# EAGLE design ts4231-breakout-module (EAGLE 6.5.0)
DESIGNER: Jon Newman; DESIGN_NAME: TS431 Breakout; LICENSE: cc-by-sa-nc; REVISION: 1.0
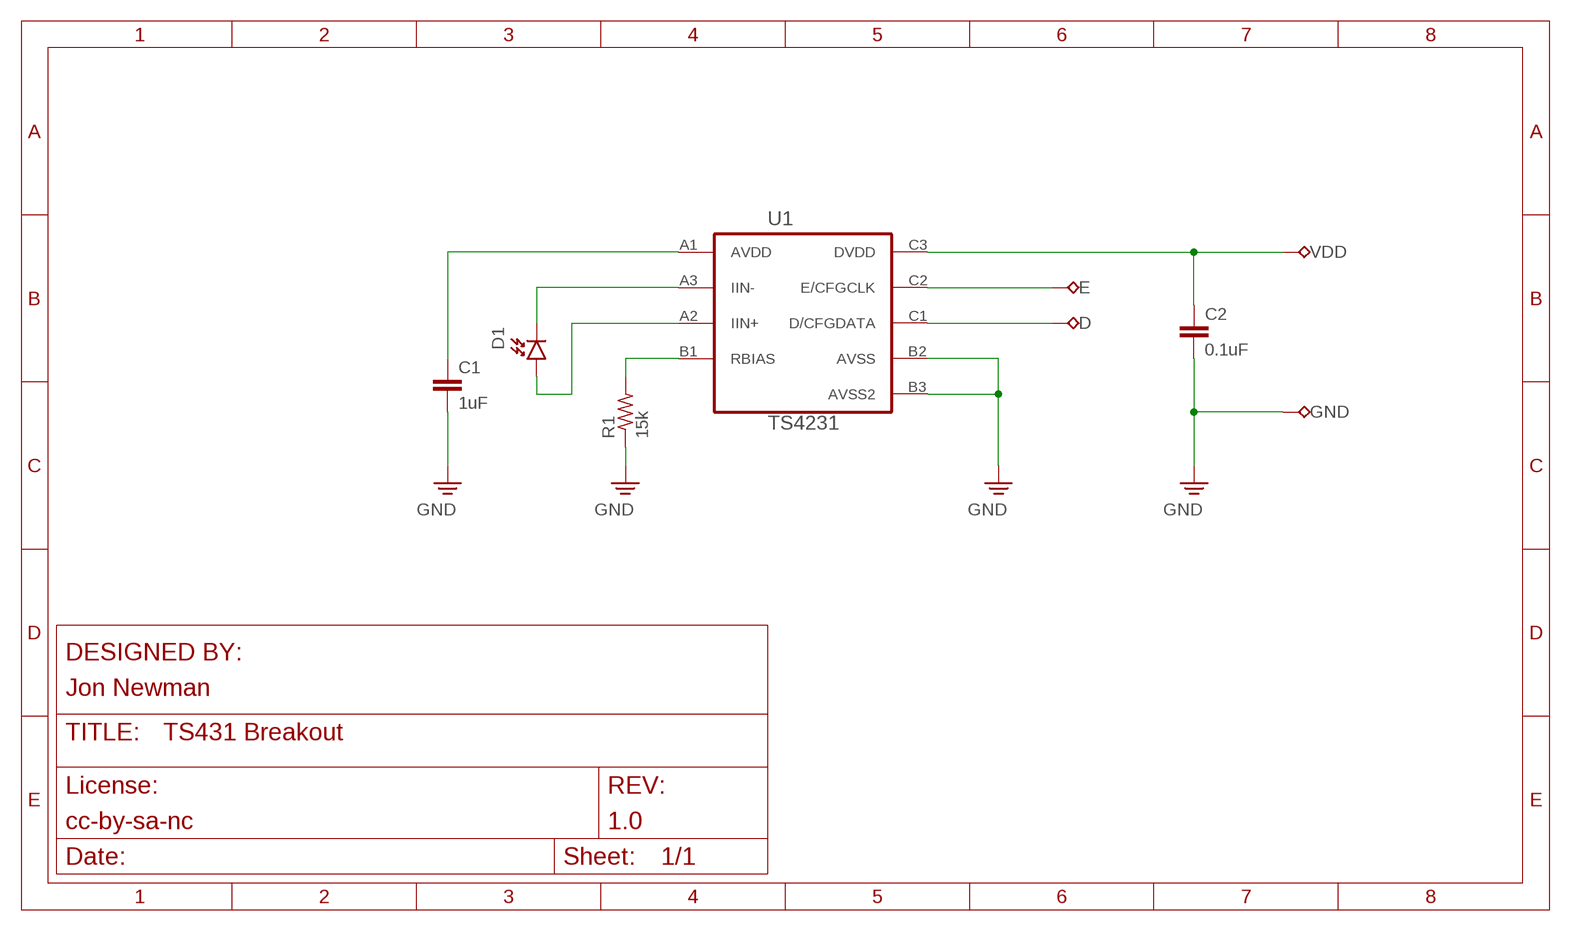
[diagram p0: schematic, sheet 1]

## Parts
C1  1uF  C_0402  [0402]
C2  0.1uF  C_0201  [0201]
D  TP_TP23MIL  [TP23MIL]
D1  PHOTODIODE_0805  [0805]
E  TP_TP23MIL  [TP23MIL]
GND  TP_TP23MIL  [TP23MIL]
R1  15k  R_0201  [0201]
U1  TS4231  [WLCSP3X3]
VDD  TP_TP23MIL  [TP23MIL]

## Nets
GND: C1.2 C2.2 GND.P$1(TP) R1.1 U1.B2(AVSS) U1.B3(AVSS2)
N$1: D.P$1(TP) U1.C1(D/CFGDATA)
N$2: E.P$1(TP) U1.C2(E/CFGCLK)
N$4: D1.2(C) U1.A3(IIN-)
N$5: D1.1(A) U1.A2(IIN+)
N$6: R1.2 U1.B1(RBIAS)
N$7: C1.1 U1.A1(AVDD)
VDD: C2.1 U1.C3(DVDD) VDD.P$1(TP)

## Library data of the parts
C1 C2 = jonnew:C: Capacitor
D E GND VDD = jonnew:TP: Test pad
D1 = jonnew:PHOTODIODE
R1 = jonnew:R: Resistor
U1 = jonnew:TS4231

## Board
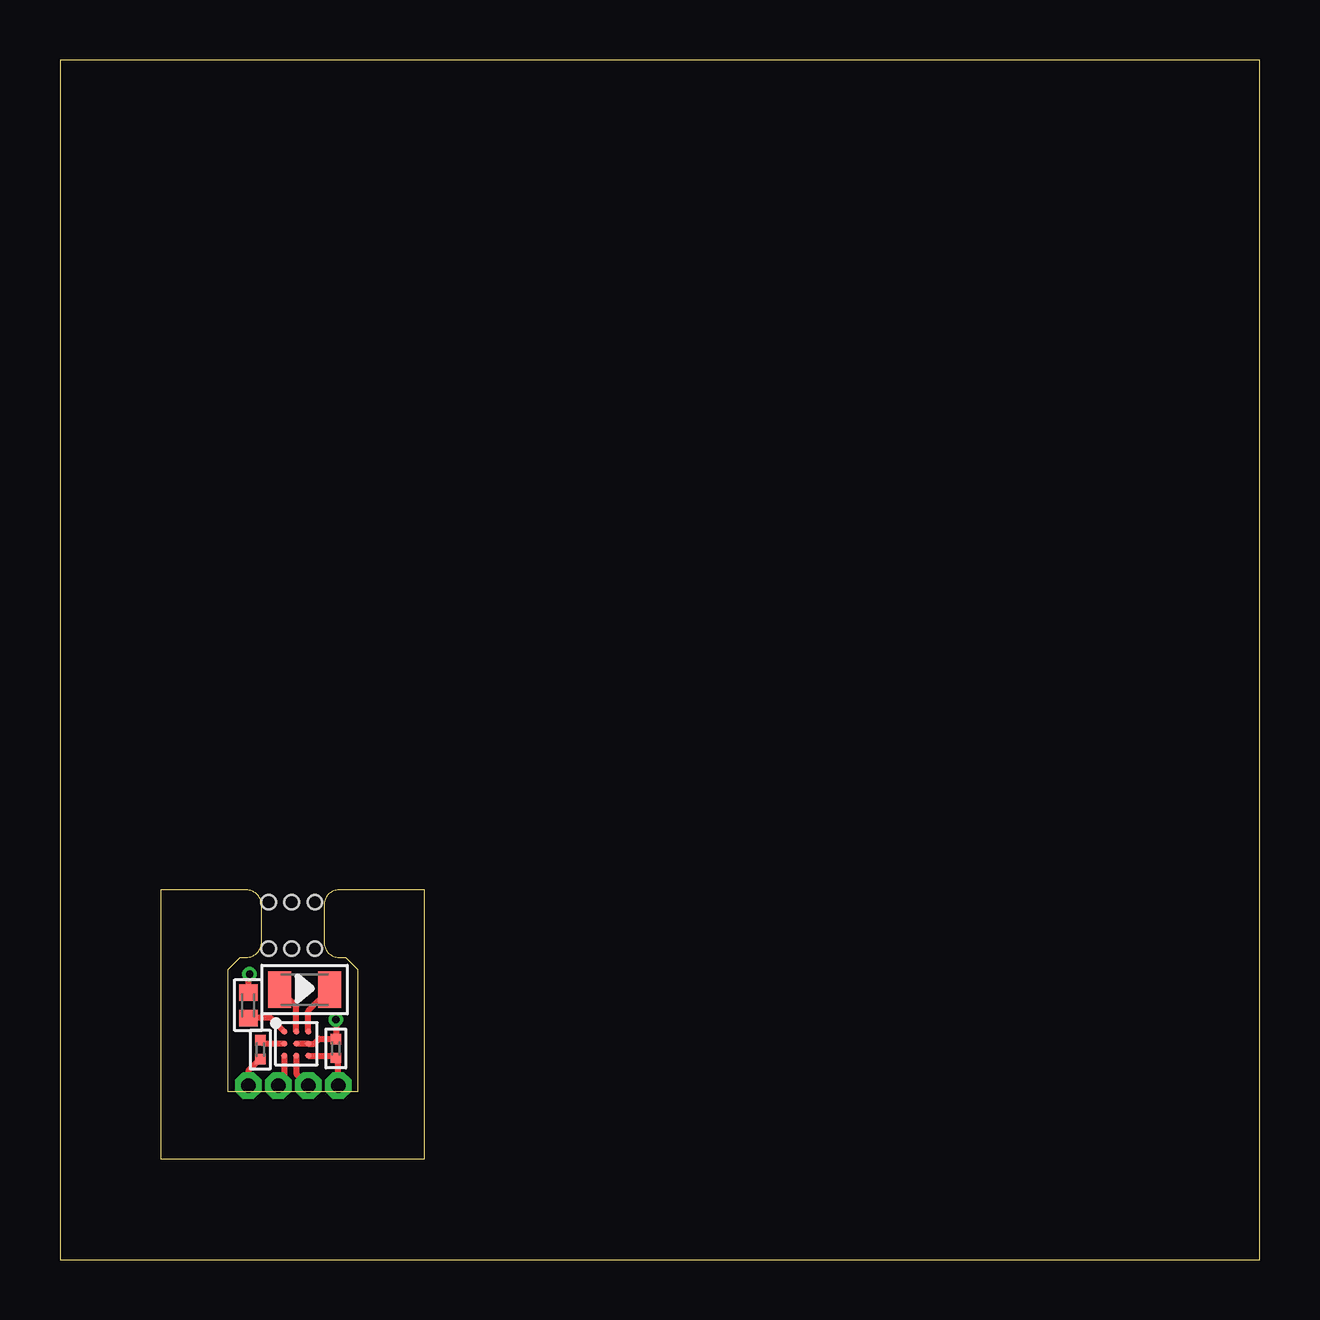
[diagram p1: board, top side]
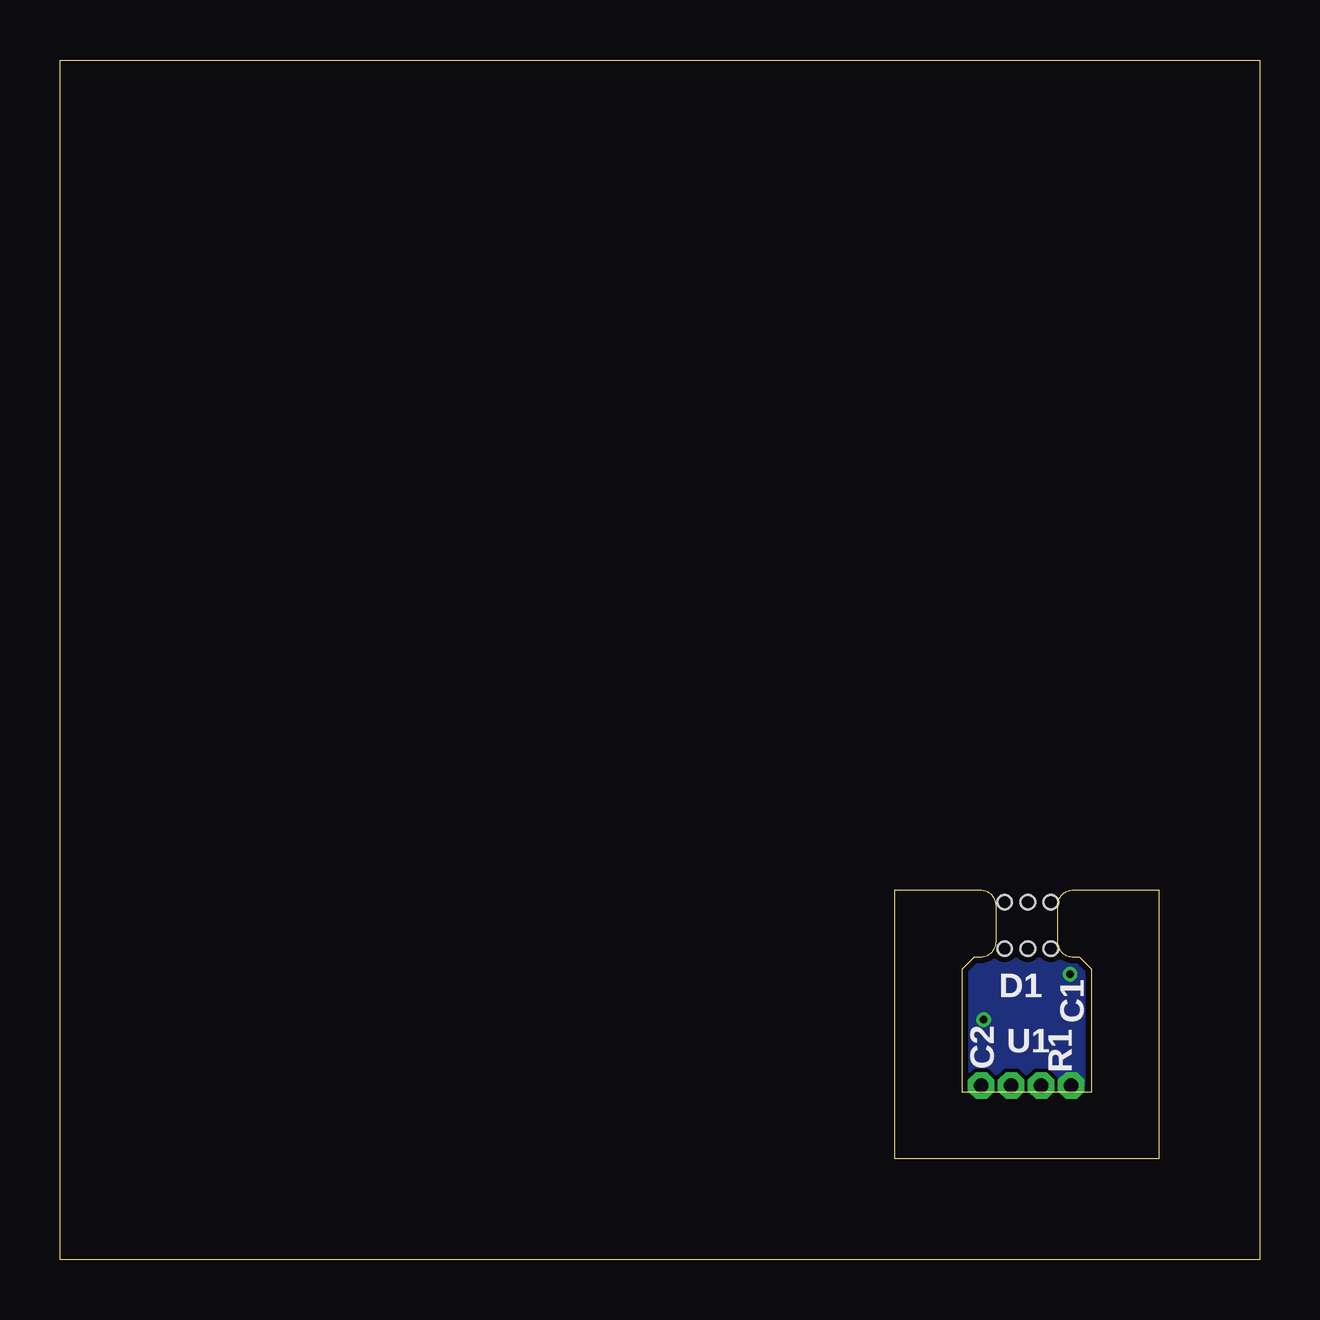
[diagram p2: board, bottom side, seen from below]

Size 50 x 50 mm. Coordinates in mm from the lower left corner, seen from the top.
Outline: 11.63,12.6 11.9,12.6 12.4,12.1 12.4,7 7,7 7,12.1 7.5,12.6 7.76,12.6 arc90 8.4,13.23 8.4,14.77 arc90 7.76,15.4 4.2,15.4 4.2,4.2 15.2,4.2 15.2,15.4 11.63,15.4 arc90 11,14.77 11,13.23 arc90 11.63,12.6
Outline: 0,0 50,0 50,50 0,50 0,0
Copper layers (1*16): Top 0.035mm / dielectric 1.5mm / Bottom 0.035mm
Design rules "seeed-studio-2-layer": minimum track width 6mil, minimum drill 12mil, track to track 6mil, track to pad 6mil, pad to pad 6mil, via to via 6mil, smd to smd 0mil, copper to edge 10mil, drill to drill 10mil, minimum pad ring 10mil, minimum via ring 6mil, stop-mask expansion 2mil, vias tented up to drill 100mil, thermal gap 10mil
Holes 0.6 mm at 8.7,14.89 9.66,14.89 10.63,14.89 8.7,12.96 9.66,12.96 10.63,12.96

### Footprints (pad centres in the part's own frame; a part is rotated, then mirrored left to right if it is on the bottom)
0402 = smd 0.686 x 0.762: 1 -0.533,0; 2 0.533,0
0201 = smd 0.432 x 0.432: 1 -0.394,0; 2 0.394,0
TP23MIL = drill 0.6 octagon: P$1 0,0
0805 = smd 0.965 x 1.524: 1 -1.041,0; 2 1.041,0
WLCSP3X3 = smd 0.25 x 0.25: A1 -0.5,0.5; A2 0,0.5; A3 0.5,0.5; B1 -0.5,0; B2 0,0; B3 0.5,0; C1 -0.5,-0.5; C2 0,-0.5; C3 0.5,-0.5

### Placement (x,y rotation side)
C1  7.85,10.6 90 top
C2  11.5,8.8 90 top
D  9.1,7.25 0 top
D1  10.2,11.25 0 top
E  10.35,7.25 0 top
GND  7.85,7.25 0 top
R1  8.35,8.75 90 top
U1  9.85,9 0 top
VDD  11.6,7.25 0 top

### Tracks (layer width: path | path; a pad name or v marks a point on that pad's centre or on a via)
GND  (via drill 0.3)
  Top 0.254: U1.B2 U1.B3 10.6,9 10.8,9.2 C2.2 v11.5,10 | R1.1 7.85,7.86 GND.P$1 | v7.9,11.9 7.85,11.75 C1.2
  pour Bottom (no thermals): 7,7 7,12.6 12.4,12.6 12.4,7
N$1
  Top 0.254: U1.C1 9.35,7.5 D.P$1
N$2
  Top 0.254: U1.C2 9.85,7.75 E.P$1
N$4
  Top 0.254: U1.A3 10.35,10.36 D1.2
N$5
  Top 0.254: U1.A2 9.85,10.56 D1.1
N$6
  Top 0.254: U1.B1 8.49,9 R1.2
N$7
  Top 0.254: U1.A1 8.78,10.07 C1.1
VDD
  Top 0.254: 11.5,8.5 C2.1 | U1.C3 11.41,8.5 C2.1 | VDD.P$1 11.6,8.31 C2.1